# Altium schematic sheet CPU.SchDoc
size A4; SheetNumber: 1; SheetTotal: 5
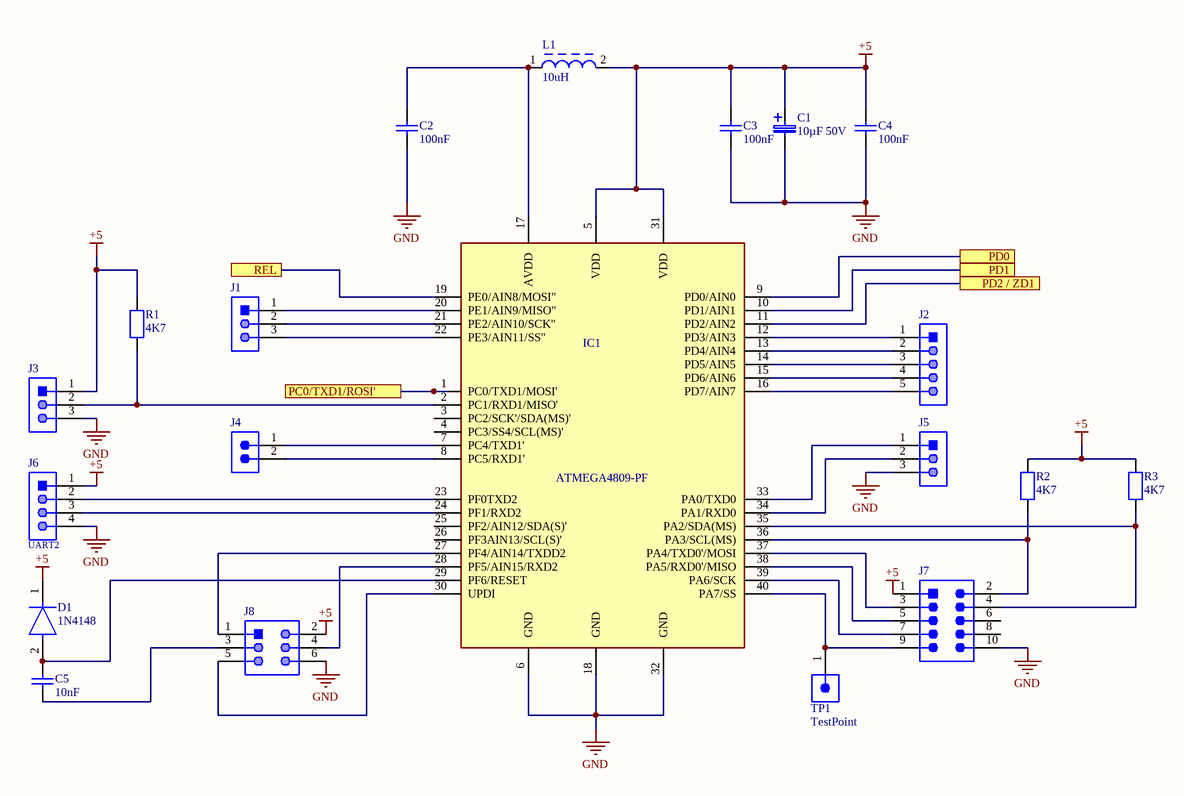
[diagram p0: CPU.SchDoc]

## Parts
C1  10µF 50V  [TAP106M050BRW]
C2  100nF  [CAPC2012X88N]
C3  100nF  [CAPC2012X88N]
C4  100nF  [CAPC2012X88N]
C5  10nF  [CAPC2012X88N]
D1  1N4148  [FP-017AG-MFG]
IC1  ATMEGA4809-PF  [ATMEGA4809-PF]
J1  61300311121  [pin header 1x3]  (value not drawn)
J2  61300511121  [pin header 1x5]  (value not drawn)
J3  61300311121  [pin header 1x3]  (value not drawn)
J4  61300211121  [61300211121]  (value not drawn)
J5  61300311121  [pin header 1x3]  (value not drawn)
J6  UART2  [pin header 1x4]
J7  1-1634688-0  [TECO-1-1634688-0-10_V]  (value not drawn)
J8  61300621121  [pin header 2x6]  (value not drawn)
L1  10uH  [SMD-1008]
R1  4K7  [RESC2012X50N]
R2  4K7  [RESC2012X50N]
R3  4K7  [RESC2012X50N]
TP1  TestPoint  [61300111121]

## Ports
PC0/TXD1/ROSI' (see SolderIronOut[1B]), PD0 (see SolderIronTemp[1A]), PD1 (see SolderIronTemp[1C]), PD2 / ZD1 (see BatterySource_RelaisOut[3B]), REL (see BatterySource_RelaisOut[1C])

## Nets
+5: C1.1 C3.2 C4.2 D1.1(C) IC1.5(VDD) IC1.31(VDD) J3.1 J6.1 J7.1 J8.2 L1.2 R1.1 R2.2 R3.2
GND: C1.2 C2.1 C3.1 C4.1 IC1.6(GND) IC1.18(GND) IC1.32(GND) J3.3 J5.3 J6.4 J7.10 J8.6
PC0/TXD1/ROSI': IC1.1(PC0/TXD1/MOSI') ; port PC0/TXD1/ROSI'
PD0: IC1.9(PD0/AIN0) ; port PD0
PD1: IC1.10(PD1/AIN1) ; port PD1
PD2 / ZD1: IC1.11(PD2/AIN2) ; port PD2 / ZD1
REL: IC1.19(PE0/AIN8/MOSI") ; port REL
NetC2_2: C2.2 IC1.17(AVDD) L1.1
NetC5_1: C5.1 J8.3
NetC5_2: C5.2 D1.2(A) IC1.29(PF6/RESET)
NetIC1_2: IC1.2(PC1/RXD1/MISO') J3.2 R1.2
NetIC1_7: IC1.7(PC4/TXD1') J4.1
NetIC1_8: IC1.8(PC5/RXD1') J4.2
NetIC1_12: IC1.12(PD3/AIN3) J2.1
NetIC1_13: IC1.13(PD4/AIN4) J2.2
NetIC1_14: IC1.14(PD5/AIN5) J2.3
NetIC1_15: IC1.15(PD6/AIN6) J2.4
NetIC1_16: IC1.16(PD7/AIN7) J2.5
NetIC1_20: IC1.20(PE1/AIN9/MISO") J1.1
NetIC1_21: IC1.21(PE2/AIN10/SCK") J1.2
NetIC1_22: IC1.22(PE3/AIN11/SS") J1.3
NetIC1_23: IC1.23(PF0TXD2) J6.2
NetIC1_24: IC1.24(PF1/RXD2) J6.3
NetIC1_27: IC1.27(PF4/AIN14/TXDD2) J8.1
NetIC1_28: IC1.28(PF5/AIN15/RXD2) J8.4
NetIC1_30: IC1.30(UPDI) J8.5
NetIC1_33: IC1.33(PA0/TXD0) J5.1
NetIC1_34: IC1.34(PA1/RXD0) J5.2
NetIC1_35: IC1.35(PA2/SDA(MS)) J7.4 R3.1
NetIC1_36: IC1.36(PA3/SCL(MS)) J7.2 R2.1
NetIC1_37: IC1.37(PA4/TXD0'/MOSI) J7.3
NetIC1_38: IC1.38(PA5/RXD0'/MISO) J7.5
NetIC1_39: IC1.39(PA6/SCK) J7.7
NetIC1_40: IC1.40(PA7/SS) J7.9 TP1.1

Not connected (* = marked no-connect by the designer): IC1 3(PC2/SCK'/SDA(MS)') 4(PC3/SS4/SCL(MS)') 25(PF2/AIN12/SDA(S)') 26(PF3AIN13/SCL(S)'); J7 6 8

## Library data of the parts
C1 = capacitor THT radial tantalum: Tantalum Capacitors - Solid Leaded 50V 10uF 20% ESR=1.6 Ohm TAP106M050BRW; Manufacturer_Name: Kyocera AVX; Geometry.Height: 15.5mm; Mouser Part Number: 581-TAP106M050BRW; Mouser Price/Stock: https://www.mouser.co.uk/ProductDetail/AVX/TAP106M050BRW?qs=GjEaAqXp9rZGx11KfVU76g%3D%3D; Manufacturer_Part_Number: TAP106M050BRW; Datasheet Link: https://www.mouser.be/datasheet/2/40/tap-776819.pdf
C2-C5 = Capacitor ceramic 0805: Manufacturer: Kemet; Part Number: C0402C104K4RACTU
D1 = D 1N4148: DIODE GEN PURP 100V 200MA DO35; Forward Voltage: 1V; Max Power Dissipation: 500mW; Max Reverse Current: 5uA; Forward Current: 300mA; Current: 4A; Reverse Recovery Time: 4ns; Element Configuration: Single; Outside Diameter: 1.85mm; Capacitance: 4pF; Polarity: Standard; Max Forward Surge Current (Ifsm): 1A; Reverse Voltage: 100V; Output Current: 200mA; Average Rectified Current: 200mA; Diameter: 1.91mm; Max Repetitive Reverse Voltage (Vrrm): 100V; Current Rating: 200mA; Case/Package: DO-35; Lead Free: Lead Free; Number of Pins: 2; Recovery Time: 4ns; Packaging: Bulk; Contact Plating: Tin; Voltage: 100V; Mount: Through Hole; Max Surge Current: 4A; Package Quantity: 2000; Width: 1.91mm; Max Reverse Voltage (DC): 100V; Length: 4.56mm; Radiation Hardening: No; Power Dissipation: 500mW; Voltage Rating (DC): 100V; Peak Non-Repetitive Surge Current: 4A; REACH SVHC: No SVHC; Height: 4.56mm; Max Operating Temperature: 175°C; Series: -; Weight: 0.01lb; Min Operating Temperature: -65°C
IC1 = ATMEGA4809-PF: IC MCU 8BIT 48KB FLASH 40DIP; RoHS Compliant: Yes
J1 J3 = pin header 1x3pin right connection: THT Vertical Pin Header WR-PHD, Pitch 2.54 mm, Single Row, 3 pins; Manufacturer: Wurth Elektronik; Withstanding Voltage: 500VAC; Working Voltage: 250VAC; Rated Current: 3A; Pitch: 2.54mm; Pin Number: 3; Gender: Male; Contact Resistance: 20mOhm; Package Reference: 61300311121; Manufacturer URL: http://www.we-online.de; Datasheet URL: https://katalog.we-online.de/em/datasheet/6130xx11121.pdf; Operating Temperature: -40to105degC; Part Number: 61300311121; Orientation: Vertical; Packaging: Bag; Row Number: Single; Mounting Technology: THT; Publisher: WurthElektronik
J2 = pin header 1x5: THT Vertical Pin Header WR-PHD, Pitch 2.54 mm, Single Row, 5 pins; Manufacturer: Wurth Elektronik; Pin Number: 5; Contact Resistance: 20mOhm; Working Voltage: 250VAC; Pitch: 2.54mm; Withstanding Voltage: 500VAC; Rated Current: 3A; Gender: Male; Datasheet URL: https://katalog.we-online.de/em/datasheet/6130xx11121.pdf; Orientation: Vertical; Mounting Technology: THT; Row Number: Single; Package Reference: 61300511121; Publisher: WurthElektronik; Part Number: 61300511121; Packaging: Bag; Manufacturer URL: http://www.we-online.de; Operating Temperature: -40to105degC
J4 = Pin header 1X2 right connection: THT Vertical Pin Header WR-PHD, Pitch 2.54 mm, Single Row, 2 pins; NexarPartId: 20081794; Operating Supply Voltage: 250V; Current Rating: 3A; Gender: Male; Number of Contacts: 2; Pitch: 2.54mm; Connector Type: Male Pin; Contact Resistance: 20mΩ; Contact Plating: Gold; Contact Material: Copper; Number of Pins: 2; Min Operating Temperature: -40°C; Packaging: Bulk; Lead Pitch: 2.54mm; Mount: Through Hole; Orientation: Vertical; RoHS: Compliant; REACH SVHC: No SVHC; Height: 8.94mm; Termination: Through Hole; Number of Positions: 2; Contact Mating Length: 5.9944mm; Color: Black; Contact Gender: Male; Number of Rows: 1; Housing Material: PBT; Lead Free: Lead Free; Voltage Rating: 250V; Max Operating Temperature: 125°C
J5 = pin header 1x3pin: THT Vertical Pin Header WR-PHD, Pitch 2.54 mm, Single Row, 3 pins; Manufacturer: Wurth Elektronik; Withstanding Voltage: 500VAC; Working Voltage: 250VAC; Rated Current: 3A; Pitch: 2.54mm; Pin Number: 3; Gender: Male; Contact Resistance: 20mOhm; Package Reference: 61300311121; Manufacturer URL: http://www.we-online.de; Datasheet URL: https://katalog.we-online.de/em/datasheet/6130xx11121.pdf; Operating Temperature: -40to105degC; Part Number: 61300311121; Orientation: Vertical; Packaging: Bag; Row Number: Single; Mounting Technology: THT; Publisher: WurthElektronik
J6 = pin header 1x4 right connection: THT Vertical Pin Header WR-PHD, Pitch 2.54 mm, Single Row, 4 pins; Manufacturer: Wurth Elektronik; Part Number: 61300411121; Withstanding Voltage: 500VAC; Rated Current: 3A; Working Voltage: 250VAC; Pin Number: 4; Gender: Male; Contact Resistance: 20mOhm; Pitch: 2.54mm; Manufacturer URL: http://www.we-online.de; Operating Temperature: -40to105degC; Packaging: Bag; Mounting Technology: THT; Package Reference: 61300411121; Datasheet URL: https://katalog.we-online.de/em/datasheet/6130xx11121.pdf; Publisher: WurthElektronik; Row Number: Single; Orientation: Vertical
J7 = CMP-2000-05854-1: Male Header, Pitch 2.54 mm, 2 x 5 Postion, Height 9.15 mm, Tail Length 3.2 mm, -40 to 105 degC, RoHS, Bulk; Manufacturer: TE Connectivity; No. of Rows: 2; SVHC: ToBeAdvised; Package Version: Rev. C2, 02/2011; No. of Contacts: 10Contacts; Pitch: 2.54mm; No. of Positions: 10; Contact Termination Type: ThroughHole; Package Description: 10-Pin Connector, Body 20.35 x 8.7 mm, Pitch 2.54 mm; Orientation: Straight; Gender: Header; Mounting Technology: ThroughHole; Product Range: -; PartNumber: 1-1634688-0; Datasheet Version: Rev. C2, 02/2011; Contact Material: Brass; Package URL: https://datasheet.ciiva.com/6831/eng-cd-1634688-c2-6831201.pdf; Package Reference: 1-1634688-0; Pitch Spacing: 2.54mm; Contact Plating: GoldPlatedContacts; Manufacturer URL: http://www.te.com/; Datasheet URL: https://datasheet.ciiva.com/6831/eng-cd-1634688-c2-6831201.pdf
J8 = pin header 2x6: THT Vertical Pin Header WR-PHD, Pitch 2.54 mm, Dual Row, 6 pins; Manufacturer: Wurth Elektronik; Contact Resistance: 20mOhm; Withstanding Voltage: 500VAC; Pin Number: 6; Gender: Male; Pitch: 2.54mm; Working Voltage: 250VAC; Rated Current: 3A; Packaging: Bag; Row Number: Dual; Manufacturer URL: http://www.we-online.de; Part Number: 61300621121; Operating Temperature: -40to105degC; Mounting Technology: THT; Package Reference: 61300621121; Datasheet URL: https://katalog.we-online.de/em/datasheet/6130xx21121.pdf; Orientation: Vertical; Publisher: WurthElektronik
L1 = Choke SMD 10uH: Power Multilayer Inductor WE-PMI, L = 10.00 µH CMP-0227-00001-1; Inductance: 10.00 ÂµH; ComponentLink2Description: Datasheet; PackageDescription: Chip Inductor, 2-Leads, Body 2.5 x 2.0 mm; PackageReference: SMD-1008; ComponentLink1URL: http://www.we-online.com; ComponentLink2URL: http://www.we-online.de/katalog/media/pdf/74479887310.pdf; ComponentLink1Description: Manufacturer Link; PackageVersion: 2008; DatasheetVersion: ver 3, Aug-2009
R1-R3 = resistor 0805: Manufacturer: Vishay Dale; Part Number: CRCW08050000Z0EA
TP1 = TestPoint: NexarPartId: 32855518; Operating Supply Voltage: 250V; Connector Type: Male Pin; Contact Resistance: 20mΩ; Number of Contacts: 1; Gender: Male; Current Rating: 3A; Contact Mating Length: 5.9944mm; Number of Pins: 1; Lead Pitch: 2.54mm; Contact Plating: Gold; RoHS: Compliant; Termination: Solder; Mount: Through Hole; Number of Rows: 1; Orientation: Vertical; Contact Material: Copper; Packaging: Bulk; REACH SVHC: Unknown; Number of Positions: 1; Color: Black